# Altium project IM板测试底板.PrjPcb
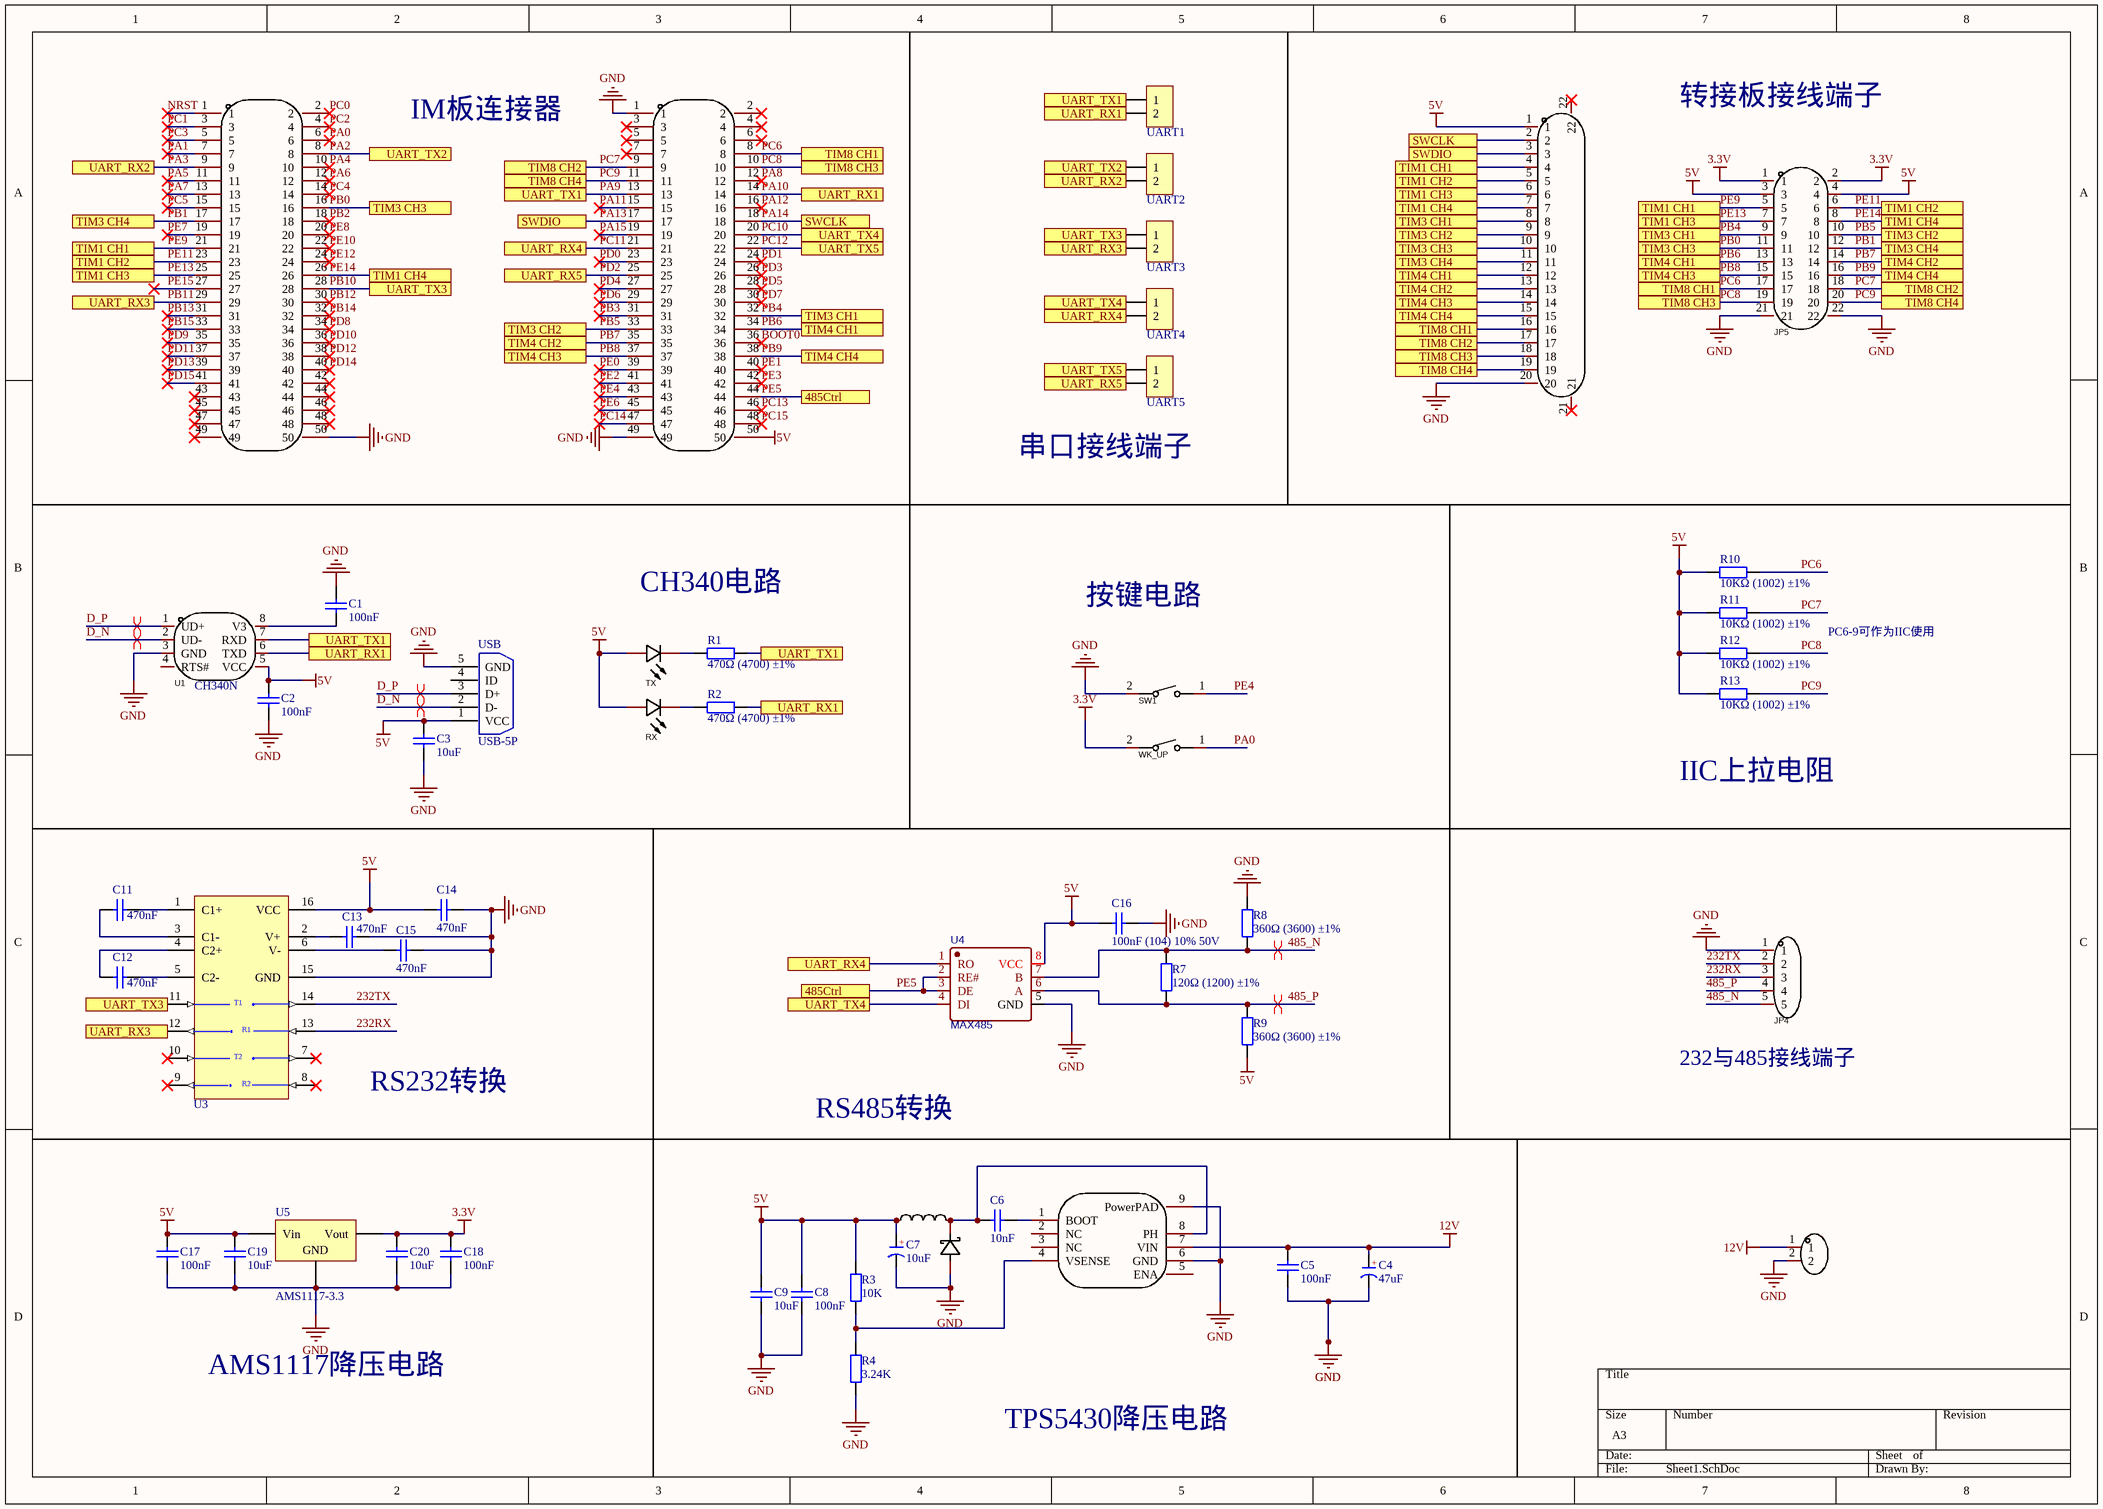
[diagram p0: Sheet1.SchDoc]
1 sheet, 53 parts. Net scope: flat (ports and power ports of the same name join across sheets).
Board file: PCB1.PcbDoc

## Sheet Sheet1.SchDoc
size A3; SheetNumber: 1; SheetTotal: 2

### Parts
C1  100nF  [0603_C]
C2  100nF  [0603_C]
C3  10uF  [0603_C]
C4  47uF  [CM D(6.3*5.4)]
C5  100nF  [0603_C]
C6  10nF  [0603_C]
C7  10uF  [CM B(4*5.4)]
C8  100nF  [0603_C]
C9  10uF  [0603_C]
C11  470nF  [0603_C]
C12  470nF  [0603_C]
C13  470nF  [0603_C]
C14  470nF  [0603_C]
C15  470nF  [0603_C]
C16  100nF (104) 10% 50V  [0603_C]
C17  100nF  [0603_C]
C18  100nF  [0603_C]
C19  10uF  [0603_C]
C20  10uF  [0603_C]
D1  SS54_C2988643  [SMB_L4.3-W3.6-LS5.4-RD]  (value not drawn)
FPC1  FPC-05F-20PH20  [FPC-SMD_20P-P0.50_XUNPU_FPC-05F-20PH20]  (value not drawn)
JP1  2685Y-225CNG1SNA01  [HDR-TH_50P-P2.54-V-F-R2-C25-S2.54-1]  (value not drawn)
JP2  2685Y-225CNG1SNA01  [HDR-TH_50P-P2.54-V-F-R2-C25-S2.54-1]  (value not drawn)
JP3  KF2EDGR-3.81-2P  [CONN-TH_2P-P3.81_KF2EDGR-3.81-2P]  (value not drawn)
JP4  KF2EDGR-3.5-5P  [CONN-TH_5P-P3.50_KF2EDGR-3.5-5P]  (value not drawn)
JP5  PZ254V-12-22P  [HDR-TH_22P-P2.54-V-M-R2-C11-S2.54]  (value not drawn)
L1  MWSA0603S-220MT  [IND-SMD_L7.3-W6.8]  (value not drawn)
R1  470Ω (4700) ±1%  [0603_R]
R2  470Ω (4700) ±1%  [0603_R]
R3  10K  [0603_R]
R4  3.24K  [0603_R]
R7  120Ω (1200) ±1%  [0603_R]
R8  360Ω (3600) ±1%  [0603_R]
R9  360Ω (3600) ±1%  [0603_R]
R10  10KΩ (1002) ±1%  [0603_R]
R11  10KΩ (1002) ±1%  [0603_R]
R12  10KΩ (1002) ±1%  [0603_R]
R13  10KΩ (1002) ±1%  [0603_R]
RX  NCD0603R1_C84263  [LED0603-RD]  (value not drawn)
SW1  TS3625A-HT  [SW-SMD_L6.1-W3.7-LS7.9]  (value not drawn)
TX  NCD0603R1_C84263  [LED0603-RD]  (value not drawn)
U1  CH340N  [SOP-8_L4.9-W3.9-P1.27-LS6.0-BL]
U3  MAX232IDR C18261  [SOIC-16_150mil]  (value not drawn)
U4  MAX485  [SOIC-8_150MIL]
U5  AMS1117-3.3  [SOT-223]
U6  TPS5430DDAR  [ESOP-8_L4.9-W3.9-P1.27-LS6.0-TL-EP]  (value not drawn)
UART1  HDR-1X2  [XH2.54-WI-2P]  (value not drawn)
UART2  HDR-1X2  [XH2.54-WI-2P]  (value not drawn)
UART3  HDR-1X2  [XH2.54-WI-2P]  (value not drawn)
UART4  HDR-1X2  [XH2.54-WI-2P]  (value not drawn)
UART5  HDR-1X2  [XH2.54-WI-2P]  (value not drawn)
USB  USB-5P  [USB-MINI-A]
WK_UP  TS3625A-HT  [SW-SMD_L6.1-W3.7-LS7.9]  (value not drawn)

### Ports
485Ctrl, SWCLK, SWDIO, TIM1 CH1, TIM1 CH2, TIM1 CH3, TIM1 CH4, TIM3 CH1, TIM3 CH2, TIM3 CH3, TIM3 CH4, TIM4 CH1, TIM4 CH2, TIM4 CH3, TIM4 CH4, TIM8 CH1, TIM8 CH2, TIM8 CH3, TIM8 CH4, UART_RX1, UART_RX2, UART_RX3, UART_RX4, UART_RX5, UART_TX1, UART_TX2, UART_TX3, UART_TX4, UART_TX5

### Nets
3.3V: C18.2 C20.2 JP5.1 JP5.2 U5.2(Vout) WK_UP.2(B)
5V: C2.2 C3.2 C7.1(A) C8.2 C9.2 C14.1 C16.1 C17.2 C19.2 FPC1.1 JP2.50 JP5.3 JP5.4 L1.1 R3.2 R9.1 R10.1 R11.1 R12.1 R13.1 RX.2(A) TX.2(A) U1.5(VCC) U3.16(VCC) U4.8(VCC) U5.3(Vin) USB.1(VCC)
12V: C4.1(A) C5.2 JP3.1 U6.7(VIN)
GND: C1.1 C2.1 C3.1 C4.2(K) C5.1 C7.2(K) C8.1 C9.1 C13.2 C14.2 C15.2 C16.2 C17.1 C18.1 C19.1 C20.1 D1.2(A) FPC1.20 JP1.50 JP2.1 JP2.49 JP3.2 JP4.1 JP5.21 JP5.22 R4.1 R8.2 SW1.2(B) U1.3(GND) U3.15(GND) U4.5(GND) U5.1(GND) U6.6(GND) U6.9(PowerPAD) USB.5(GND)
232RX: JP4.3 U3.13(R1IN)
232TX: JP4.2 U3.14(T1OUT)
485_N: JP4.5 R7.2 R8.1 U4.7(B)
485_P: JP4.4 R7.1 R9.2 U4.6(A)
BOOT0: JP2.36
D_N: U1.2(UD-) USB.2(D-)
D_P: U1.1(UD+) USB.3(D+)
NRST: JP1.1
PA0: JP1.6 WK_UP.1(A)
PA1: JP1.7
PA2: JP1.8 UART2.1 ; port UART_TX2
PA3: JP1.9 UART2.2 ; port UART_RX2
PA4: JP1.10
PA5: JP1.11
PA6: JP1.12
PA7: JP1.13
PA8: JP2.12
PA9: JP2.13 R1.2 U1.7(RXD) UART1.1 ; port UART_TX1
PA10: JP2.14 R2.2 U1.6(TXD) UART1.2 ; port UART_RX1
PA11: JP2.15
PA12: JP2.16
PA13: FPC1.3 JP2.17 ; port SWDIO
PA14: FPC1.2 JP2.18 ; port SWCLK
PA15: JP2.19
PB0: FPC1.10 JP1.16 JP5.11 ; port TIM3 CH3
PB1: FPC1.11 JP1.17 JP5.12 ; port TIM3 CH4
PB2: JP1.18
PB3: JP2.31
PB4: FPC1.8 JP2.32 JP5.9 ; port TIM3 CH1
PB5: FPC1.9 JP2.33 JP5.10 ; port TIM3 CH2
PB6: FPC1.12 JP2.34 JP5.13 ; port TIM4 CH1
PB7: FPC1.13 JP2.35 JP5.14 ; port TIM4 CH2
PB8: FPC1.14 JP2.37 JP5.15 ; port TIM4 CH3
PB9: FPC1.15 JP2.38 JP5.16 ; port TIM4 CH4
PB10: JP1.28 U3.11(T1IN) UART3.1 ; port UART_TX3
PB11: JP1.29 U3.12(R1OUT) UART3.2 ; port UART_RX3
PB12: JP1.30
PB13: JP1.31
PB14: JP1.32
PB15: JP1.33
PC0: JP1.2
PC1: JP1.3
PC2: JP1.4
PC3: JP1.5
PC4: JP1.14
PC5: JP1.15
PC6: FPC1.16 JP2.8 JP5.17 R10.2 ; port TIM8 CH1
PC7: FPC1.17 JP2.9 JP5.18 R11.2 ; port TIM8 CH2
PC8: FPC1.18 JP2.10 JP5.19 R12.2 ; port TIM8 CH3
PC9: FPC1.19 JP2.11 JP5.20 R13.2 ; port TIM8 CH4
PC10: JP2.20 U4.4(DI) UART4.1 ; port UART_TX4
PC11: JP2.21 U4.1(RO) UART4.2 ; port UART_RX4
PC12: JP2.22 UART5.1 ; port UART_TX5
PC13: JP2.46
PC14: JP2.47
PC15: JP2.48
PD0: JP2.23
PD1: JP2.24
PD2: JP2.25 UART5.2 ; port UART_RX5
PD3: JP2.26
PD4: JP2.27
PD5: JP2.28
PD6: JP2.29
PD7: JP2.30
PD8: JP1.34
PD9: JP1.35
PD10: JP1.36
PD11: JP1.37
PD12: JP1.38
PD13: JP1.39
PD14: JP1.40
PD15: JP1.41
PE0: JP2.39
PE1: JP2.40
PE2: JP2.41
PE3: JP2.42
PE4: JP2.43 SW1.1(A)
PE5: JP2.44 U4.2(RE#) U4.3(DE) ; port 485Ctrl
PE6: JP2.45
PE7: JP1.19
PE8: JP1.20
PE9: FPC1.4 JP1.21 JP5.5 ; port TIM1 CH1
PE10: JP1.22
PE11: FPC1.5 JP1.23 JP5.6 ; port TIM1 CH2
PE12: JP1.24
PE13: FPC1.6 JP1.25 JP5.7 ; port TIM1 CH3
PE14: FPC1.7 JP1.26 JP5.8 ; port TIM1 CH4
PE15: JP1.27
NetC1_2: C1.2 U1.8(V3)
NetC6_1: C6.1 D1.1(K) L1.2 U6.8(PH)
NetC6_2: C6.2 U6.1(BOOT)
NetC11_1: C11.1 U3.3(C1-)
NetC11_2: C11.2 U3.1(C1+)
NetC12_1: C12.1 U3.4(C2+)
NetC12_2: C12.2 U3.5(C2-)
NetC13_1: C13.1 U3.2(V+)
NetC15_1: C15.1 U3.6(V-)
NetR1_1: R1.1 TX.1(K)
NetR2_1: R2.1 RX.1(K)
NetR3_1: R3.1 R4.2 U6.4(VSENSE)

Not connected (* = marked no-connect by the designer): FPC1 21* 22*; JP1 42* 43* 44* 45* 46* 47* 48* 49*; JP2 2* 3* 4* 5* 6* 7*; U1 4(RTS#); U3 7(T2OUT)* 8(R2IN)* 9(R2OUT)* 10(T2IN)*; U6 2(NC) 3(NC) 5(ENA); USB 4(ID)

### Layout directives
differential pair: 485_N, 485_P, D_N, D_P

### Notes on the sheet
- 转接板接线端子
- IM板连接器
- 串口接线端子
- CH340电路
- 按键电路
- PC6-9可作为IIC使用
- IIC上拉电阻
- RS232转换
- RS485转换
- (near JP4) 232与485接线端子
- AMS1117降压电路
- TPS5430降压电路
- (in symbol C-CM) +
- (in symbol MAX3232IDR C18261) T1; R1; T2; R2

### Library data of the parts
C1 C2 C5 C8 C11-C18 = 0603 100nF (104) 10% 50V: 贴片电容; ComponentLink1Description: 供应商链接; ComponentLink1URL: http://www.szlcsc.com/product/details_15331.html; Package: 0603; Supplier: LC; SuppliersPartNumber: C14663
C3 C9 C19 C20 = 0603 10uF (106) 10% 10V: 贴片电容; ComponentLink1Description: 供应商链接; ComponentLink1URL: http://www.szlcsc.com/product/details_20411.html; Package: 0603; Supplier: LC; SuppliersPartNumber: C19702
C4 C7 = C-CM: 贴片电解电容; 版权归属: 源创客; BOM名称: 贴片电解电容; 学习资源: www.ooocke.com
C6 = 0603 10nF (103) 10% 50V: 贴片电容; ComponentLink1Description: 供应商链接; ComponentLink1URL: http://www.szlcsc.com/product/details_58143.html; Package: 0603; Supplier: LC; SuppliersPartNumber: C57112
D1 = SS54_C2988643: Manufacturer: UMW(广东友台半导体); Name: SS54; Add into BOM: yes; Reverse Voltage (Vr): 40V; Average Rectified Current (Io): 5A; Forward Voltage (Vf@If): 600mV@5A; Reverse Leakage Current (Ir): 1mA@40V; Symbol: SS54_C2988643; Device: SS54_C2988643; LCSC Part Name: 40V 5A 600mV@5A; Supplier Part: C2988643; Manufacturer Part: SS54; Supplier Footprint: SMB; JLCPCB Part Class: Extended Part; Datasheet: https://atta.szlcsc.com/upload/public/pdf/source/20220412/DFE4B5D1FBAE230579785280D401C062.pdf; Supplier: LCSC; Convert to PCB: yes
FPC1 = FPC-05F-20PH20: Manufacturer: XUNPU(讯普); Add into BOM: yes; Name: FPC-05F-20PH20; Symbol: FPC-05F-20PH20; Device: FPC-05F-20PH20; LCSC Part Name: 20P 0.5mm; Supplier Part: C2856803; Manufacturer Part: FPC-05F-20PH20; Supplier Footprint: SMD; JLCPCB Part Class: Extended Part; Supplier: LCSC; Convert to PCB: yes
JP1 JP2 = 2685Y-225CNG1SNA01: Manufacturer: 华宇创; Add into BOM: yes; Number of Holes: 50P; Pitch: 2.54mm; Holes Structure: 2x25P; Name: 2685Y-225CNG1SNA01; Symbol: 2685Y-225CNG1SNA01; Device: 2685Y-225CNG1SNA01; LCSC Part Name: 2.54mm 2x25P Y型//环保耐高温/镀金; Supplier Part: C350296; Manufacturer Part: 2685Y-225CNG1SNA01; Supplier Footprint: 插件,P=2.54mm; JLCPCB Part Class: Extended Part; Datasheet: https://atta.szlcsc.com/upload/public/pdf/source/20181220/C350296_D2530F60C4B7AD26B2D0A354C76F8429.pdf; Supplier: LCSC; Convert to PCB: yes; Number of Rows: 双排; Row Spacing: 2.54mm; Mounting Type: 直插; Insulation Height: -; Contact Material: 黄铜; Contact Plating: -
JP3 = KF2EDGR-3.81-2P: Manufacturer: KEFA(科发); Add into BOM: yes; Connector Type: 板端/插座-闭口; Structure: 1x2P; Pitch: 3.81mm; Number of PINs Per Row: 2; Current Rating (Max): 8A; Voltage Rating (Max): 300V; Name: KF2EDGR-3.81-2P; Symbol: KF2EDGR-3.81-2P; Device: KF2EDGR-3.81-2P; LCSC Part Name: 板端/插座-闭口 1x2P 3.81mm 排数:1 每排P数:2 弯针; Supplier Part: C441182; Manufacturer Part: KF2EDGR-3.81-2P; Supplier Footprint: 弯插,P=3.81mm; JLCPCB Part Class: Extended Part; Datasheet: https://atta.szlcsc.com/upload/public/pdf/source/20230331/6258E6C6BF04EFF922F3E5A9E72A4547.pdf; Supplier: LCSC; Convert to PCB: yes; Number of Rows: 1; Mounting Style: 弯针; Operating Temperature Range: -40℃~+105℃; Color: 绿色
JP4 = KF2EDGR-3.5-5P: Manufacturer: KEFA(科发); Add into BOM: yes; Connector Type: 板端/插座-闭口; Pitch: 3.5mm; Number of PINs Per Row: 5; Current Rating (Max): 8A; Voltage Rating (Max): 300V; Name: KF2EDGR-3.5-5P; Symbol: KF2EDGR-3.5-5P; Device: KF2EDGR-3.5-5P; LCSC Part Name: 板端/插座-闭口 3.5mm 排数:1 每排P数:5 弯针; Supplier Part: C441174; Manufacturer Part: KF2EDGR-3.5-5P; Supplier Footprint: P=3.5mm; JLCPCB Part Class: Extended Part; Datasheet: https://atta.szlcsc.com/upload/public/pdf/source/20191023/C441174_3952556C0659C22A17E7C4561A2B2291.pdf; Supplier: LCSC; Convert to PCB: yes; Number of Rows: 1; Mounting Style: 弯针; Wire Gauge - AWG: -; Wire Gauge - mm?: -; Operating Temperature Range: -40℃~+105℃; Color: 绿色
JP5 = PZ254V-12-22P: HDR2.54 2x11P; Manufacturer: XFCN(兴飞); Add into BOM: yes; Pitch: 2.54mm; Circluar Pins/Square Pins: 方针; Name: PZ254V-12-22P; Symbol: PZ254V-12-22P; Device: PZ254V-12-22P; LCSC Part Name: 2.54mm 2x11P 直插 方针; Supplier Part: C492428; Manufacturer Part: PZ254V-12-22P; Supplier Footprint: 直插,P=2.54mm; JLCPCB Part Class: Extended Part; Supplier: LCSC; Convert to PCB: yes; Number of Rows: 双排; Number of Pins: 22; Pin Structure: 2x11P; Row Spacing: 2.54mm; Mounting Type: 直插; Current Rating (Max): -; Voltage Rating (Max): -; Length of Mating Pin: 6mm; Insulation Height: 2.5mm; Length of End Connection Pin: 3mm; Contact Material: 黄铜; Contact Plating: -; Operating Temperature Range: -40℃~+105℃; Color: 黑色
L1 = MWSA0603S-220MT: 22uH; Manufacturer: Sunlord(顺络); Add into BOM: yes; Rated Current: 2.5A; Tolerance: ±20%; DC Resistance (DCR): 170mΩ; Name: 22uH; Symbol: MWSA0603S-220MT; Device: MWSA0603S-220MT; LCSC Part Name: 22uH ±20%; Supplier Part: C408453; Manufacturer Part: MWSA0603S-220MT; Supplier Footprint: SMD; JLCPCB Part Class: Extended Part; Datasheet: https://atta.szlcsc.com/upload/public/pdf/source/20190729/C408453_64865E9628338F56CB759A725C0B9F8F.pdf; Supplier: LCSC; Convert to PCB: yes; Width: 7mm; Length: 6.6mm; Height: 3mm; Value: 22uH
R1 R2 = 0603 470Ω (4700) 1%: 贴片电阻; ComponentLink1Description: 供应商链接; ComponentLink1URL: http://www.szlcsc.com/product/details_23906.html; Package: 0603; Supplier: LC; SuppliersPartNumber: C23179
R3 R4 = 0603 1.1KΩ (1101) 1%: 贴片电阻; ComponentLink1Description: 供应商链接; ComponentLink1URL: http://www.szlcsc.com/product/details_23491.html; Package: 0603; Supplier: LC; SuppliersPartNumber: C22764
R7 = 0603 120Ω (1200) 1%: 贴片电阻; ComponentLink1Description: 供应商链接; ComponentLink1URL: http://www.szlcsc.com/product/details_23514.html; Package: 0603; Supplier: LC; SuppliersPartNumber: C22787
R8 R9 = 0603 360Ω (3600) 1%: 贴片电阻; ComponentLink1Description: 供应商链接; ComponentLink1URL: http://www.szlcsc.com/product/details_25937.html; Package: 0603; Supplier: LC; SuppliersPartNumber: C25194
R10-R13 = 0603 10KΩ (1002) 1%: 贴片电阻; ComponentLink1Description: 供应商链接; ComponentLink1URL: http://www.szlcsc.com/product/details_26547.html; Package: 0603; Supplier: LC; SuppliersPartNumber: C25804
RX TX = 0603 LED-RD: Manufacturer: 国星光电; Symbol: FC-DA1608HRK-620D; Add into BOM: yes; Emitted Color: 红灯; Name: NCD0603R1; Device: NCD0603R1_C84263; LCSC Part Name: 红灯; Supplier Part: C84263; Manufacturer Part: NCD0603R1; Supplier Footprint: 0603; JLCPCB Part Class: Extended Part; Datasheet: https://atta.szlcsc.com/upload/public/pdf/source/20200820/C84263_DABC6A75E58F576973B407FDBA283D60.pdf; Supplier: LCSC; Convert to PCB: yes
SW1 WK_UP = TS3625A-HT: 红头按键; Manufacturer: SHOU HAN(首韩); Add into BOM: yes; Contact Current: 50mA; Voltage Rating (DC): 36V; Circuit: 单刀单掷; Actuator Style: 矩形按钮; Operating Force: 250gf@±30gf; Switch Length: 6.1mm; Switch Width: 3.65mm; Switch Height: 2.5mm; Name: TS3625A-HT; Symbol: TS3625A-HT; Device: TS3625A-HT; LCSC Part Name: 6.1*3.65*2.5mm 立贴 轻触开关; Supplier Part: C412368; Manufacturer Part: TS3625A-HT; Supplier Footprint: SMD,3.7x6.1mm; JLCPCB Part Class: Extended Part; Datasheet: https://atta.szlcsc.com/upload/public/pdf/source/20190816/C412368_ED995B38C5F41C525244887EA1991E6A.pdf; Supplier: LCSC; Convert to PCB: yes; Mounting Style: 立贴; With Lamp: -; Mechanical Life: -
U1 = CH340N_C2977777: Designer: U?; Symbol: CH340N_C2977777; Device: CH340N_C2977777
U3 = MAX3232IDR C18261: +3.3V Powered, Multi-Channel RS-232 Driver/Receiver; Published: 16-Jan-2001; LatestRevisionDate: 13-Apr-2006; LatestRevisionNote: IPC-7351 Footprint Added.; PackageReference: NSO16; Publisher: Altium Limited; PackageDescription: 16-Pin Small Outline Integrated Circuit 1.27 mm Pitch; Code_JEDEC: MS-012-AC; Code_IPC: SOIC127P600-16; ComponentLink1Description: Manufacturer Link; ComponentLink1URL: http://www.maxim-ic.com/; ComponentLink2Description: Datasheet; ComponentLink2URL: https://item.szlcsc.com/18956.html
U4 = MAX3485ESA+T C18148: 485芯片; BOM_Manufacturer: MAXIM; SMT Type: Extend; BOM_Supplier: LCSC; BOM_Manufacturer Part: MAX3485ESA+T; image: //image.lceda.cn/szlcsc/C18148.jpg; BOM_Supplier Part: C18148; BOM_LCSC Assembly: Yes; spicePre: U; URL: https://item.szlcsc.com/18840.html
U5 = SOT-223 AMS1117-3.3: 低压差线性稳压(LDO); ComponentLink1Description: 供应商链接; ComponentLink1URL: http://www.szlcsc.com/product/details_6652.html; Package: SOT-223; Supplier: LC; SuppliersPartNumber: C6186
U6 = TPS5430DDAR: Manufacturer: TI(德州仪器); Add into BOM: yes; Function: 降压型; Name: TPS5430DDAR; Symbol: TPS5430DDAR; Device: TPS5430DDAR; LCSC Part Name: 降压型; Supplier Part: C9864; Manufacturer Part: TPS5430DDAR; Supplier Footprint: SO-8; JLCPCB Part Class: Basic Part; Datasheet: https://atta.szlcsc.com/upload/public/pdf/source/20161207/1481104217724.pdf; Supplier: LCSC; Convert to PCB: yes; Synchronous Rectification: -; Number of Outputs: -; Topology: -; Input Voltage: -; Output Current (Max): -; Switching Frequency: -
UART1-UART5 = Header 2 Pitch2.54: 2P接插件; 版权归属: 源创客; BOM名称: 2P接插件; 学习资源: www.ooocke.com
USB = USB-5P: 微型USB母座; 版权归属: 源创客; BOM名称: 微型USB母座; 学习资源: www.ooocke.com